# EasyEDA schematic SCH_RAILWAY TRACK CRACK DETECTION SYSTEM_2021-07-08.json
TITLE: RAILWAY TRACK CRACK DETECTION SYSTEM; REV: 1.0; Date: 2021-05-22; Sheet: 1/1; Drawn By: ATUL DIGHE; Company: SAI SOLUTIONS
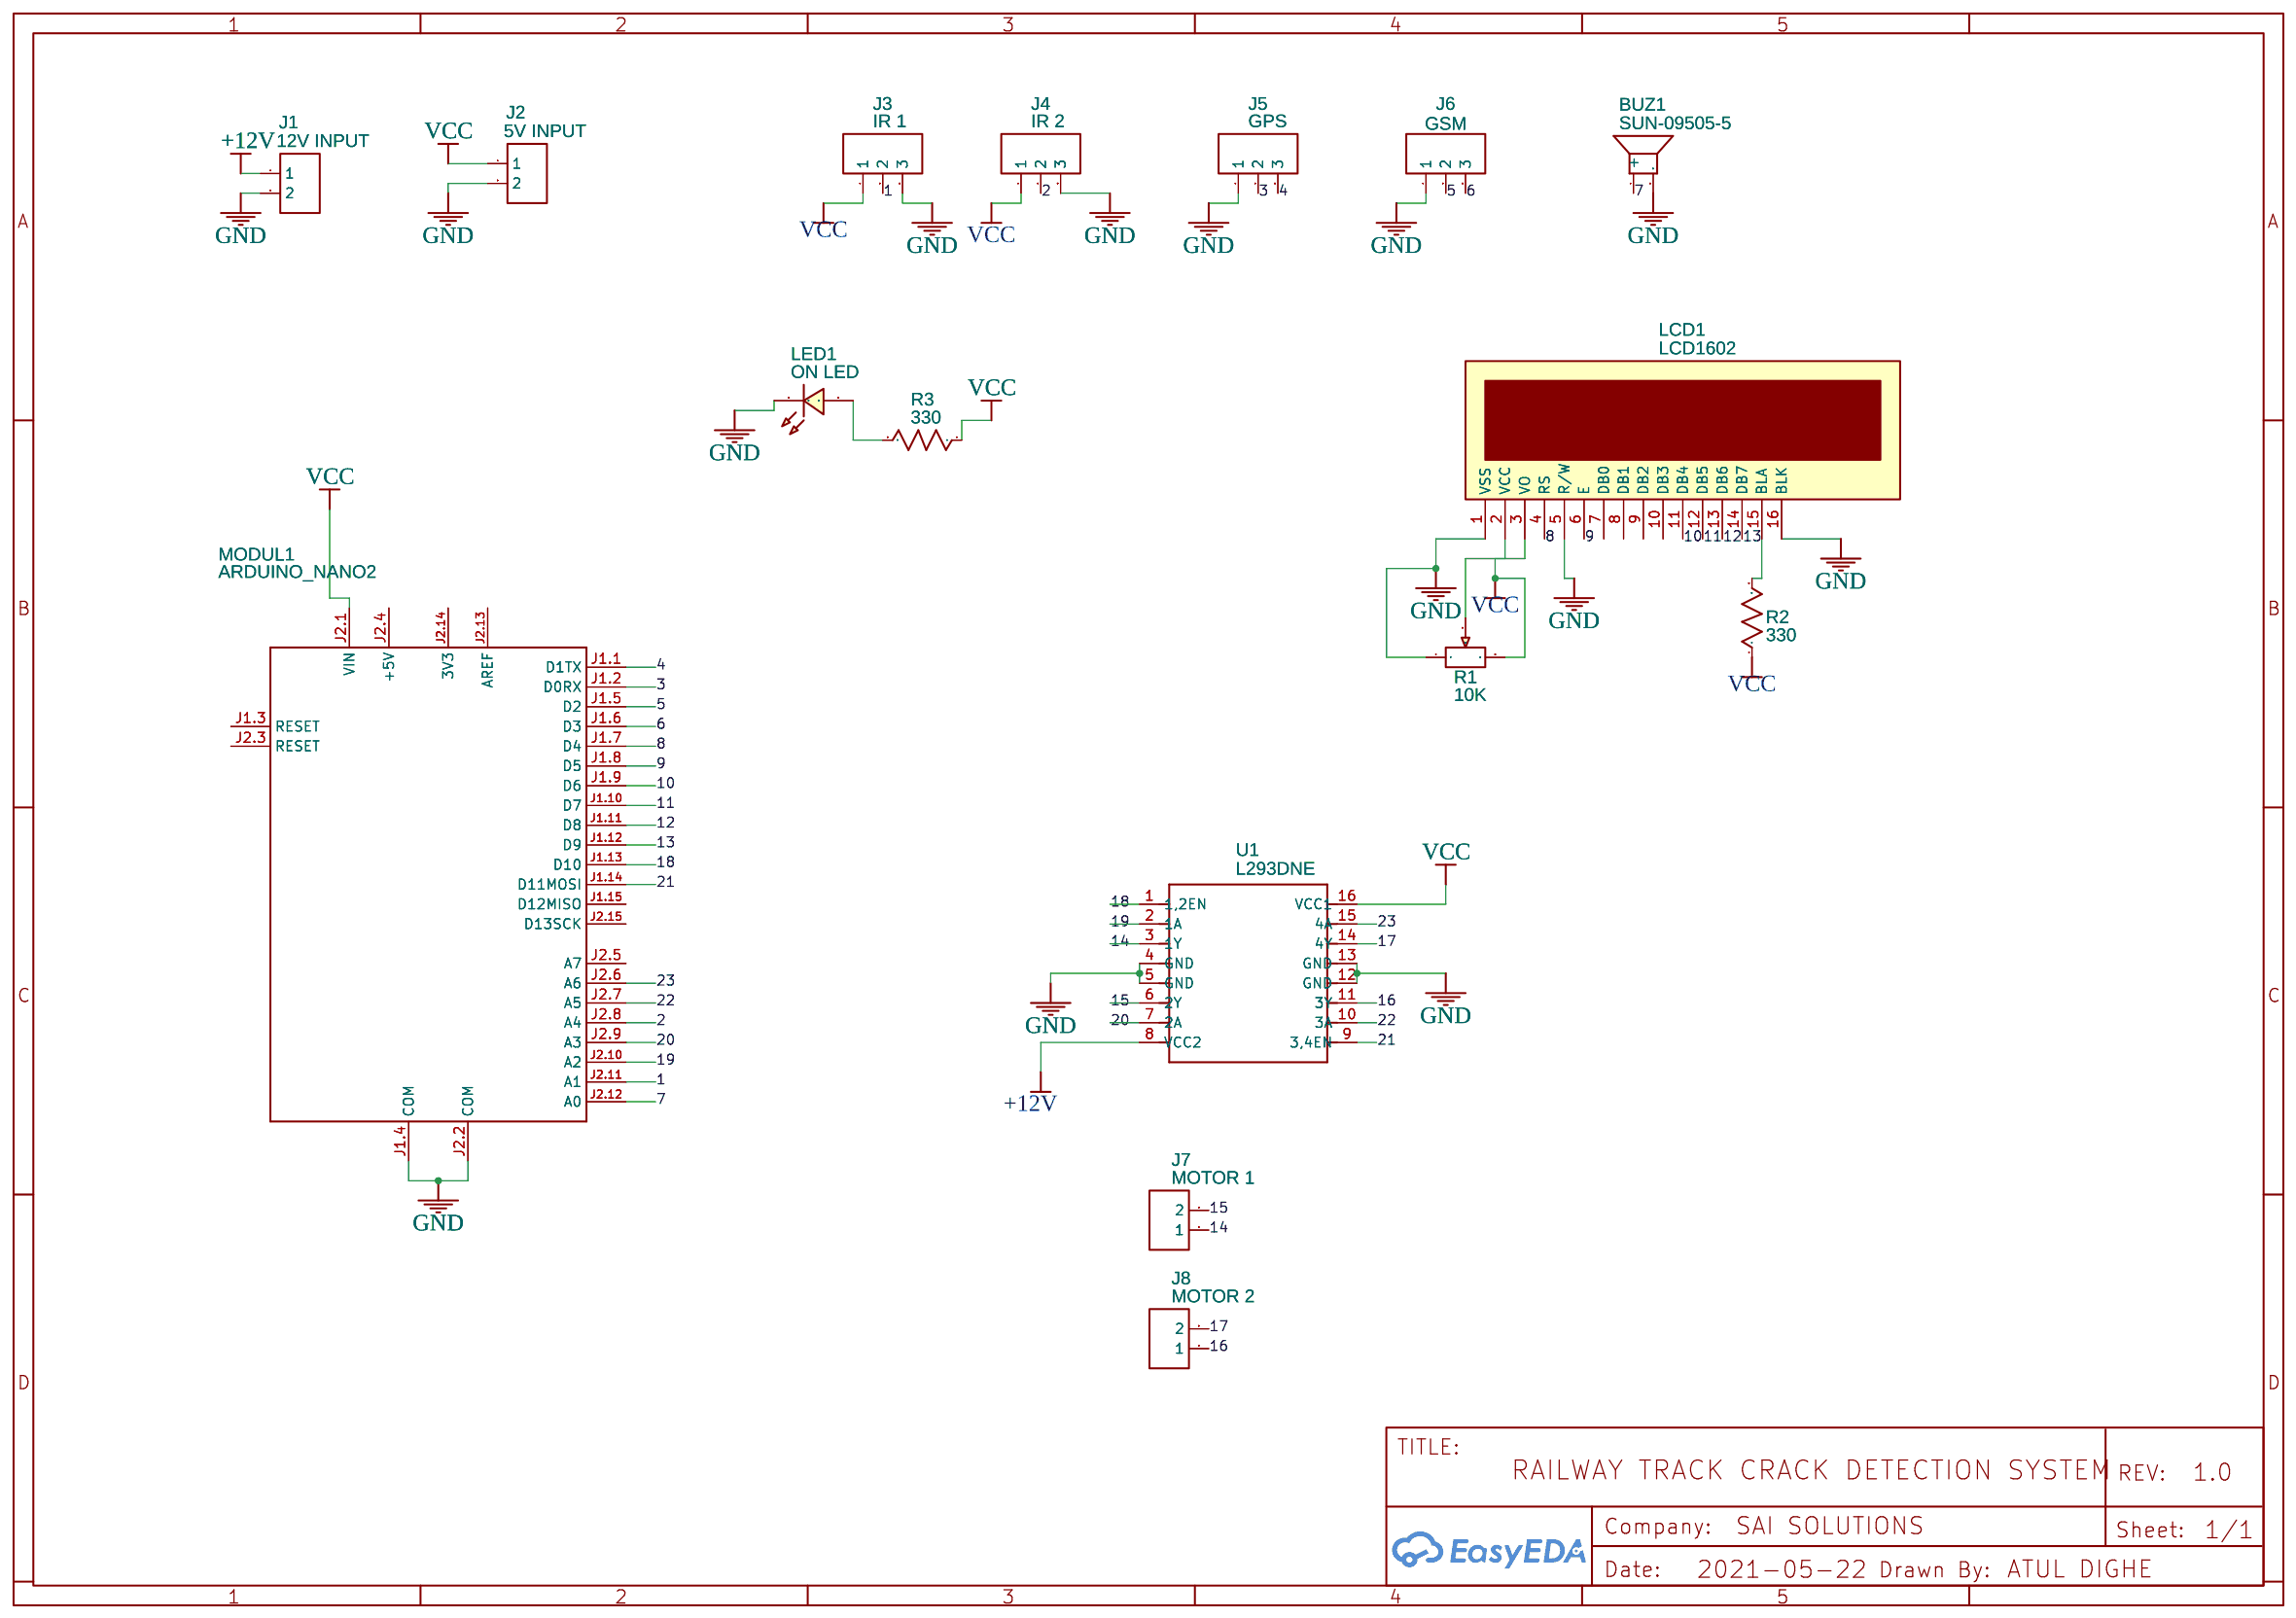
[diagram p0: schematic sheet]

## Parts
BUZ1  SUN-09505-5  [BUZ-TH_BD9.6-P5.00-D0.7-FD]
J1  12V INPUT  [HDR-M-2.54_1X2]
J2  5V INPUT  [HDR-M-2.54_1X2]
J3  IR 1  [HDR-M-2.54_1X3]
J4  IR 2  [HDR-M-2.54_1X3]
J5  GPS  [HDR-M-2.54_1X3]
J6  GSM  [HDR-M-2.54_1X3]
J7  MOTOR 1  [HDR-M-2.54_1X2]
J8  MOTOR 2  [HDR-M-2.54_1X2]
LCD1  LCD1602  [LCD1602]
LED1  ON LED  [LED-TH_BD5.0_RED]
MODUL1  ARDUINO_NANO2  [ARDUINO_NANO2]
R1  10K  [RES-ADJ-TH_RM063-103]
R2  330  [R_AXIAL-0.4]
R3  330  [R_AXIAL-0.4]
U1  L293DNE  [DIP16-2.54-19.2X7.62MM]

## Library data of the parts
BUZ1 = SUN-09505-5: Supplier Part: C2862; Supplier: LCSC; Manufacturer: ReliaPro
J1 J2 J7 J8 = HDR-M-2.54_1x2: Supplier Part: C124375; Supplier: LCSC; Contributor: LCEDA_Lib
J3-J6 = HDR-M-2.54_1x3: Supplier Part: C180248; Supplier: LCSC; Contributor: LCEDA_Lib
LCD1 = LCD1602: Manufacturer: LONTECH(厦门龙特); Manufacturer Part: LCM1602K-NSW-BBW; Supplier Part: C83275; Supplier: LCSC; Contributor: LCEDA_Lib
LED1 = LED-TH-5mm_R: Manufacturer: EVERLIGHT(台湾亿光); Manufacturer Part: 333-2SURD/S530-A3; Supplier Part: C87271; Supplier: LCSC; Contributor: LCEDA_Lib
MODUL1 = ARDUINO_NANO2
R1 = RM063-103 10K: Supplier: LCSC; Manufacturer: JML; Supplier Part: C38793; Package Display: No
R2 R3 = R_AXIAL-0.4_US: Contributor: LCEDA_Lib
U1 = L293DNE: DIP IC Driver;; sourceId: qoicuM4mD

## Nets
+12V: J1.1 U1.8(VCC2)
GND: BUZ1.2 J1.2 J2.2 J3.3 J4.3 J5.1 J6.1 LCD1.1(VSS) LCD1.5(R/W) LCD1.16(BLK) LED1.2 MODUL1.J1.4(COM) MODUL1.J2.2(COM) R1.1 U1.4(GND) U1.5(GND) U1.12(GND) U1.13(GND)
VCC: J2.1 J3.1 J4.1 LCD1.2(VCC) MODUL1.J2.1(VIN) R1.3 R2.1 R3.1 U1.16(VCC1)
1: J3.2 MODUL1.J2.11(A1)
2: J4.2 MODUL1.J2.8(A4)
3: J5.2 MODUL1.J1.2(D0RX)
4: J5.3 MODUL1.J1.1(D1TX)
5: J6.2 MODUL1.J1.5(D2)
6: J6.3 MODUL1.J1.6(D3)
7: BUZ1.1(+) MODUL1.J2.12(A0)
8: LCD1.4(RS) MODUL1.J1.7(D4)
9: LCD1.6(E) MODUL1.J1.8(D5)
10: LCD1.11(DB4) MODUL1.J1.9(D6)
11: LCD1.12(DB5) MODUL1.J1.10(D7)
12: LCD1.13(DB6) MODUL1.J1.11(D8)
13: LCD1.14(DB7) MODUL1.J1.12(D9)
14: J7.1 U1.3(1Y)
15: J7.2 U1.6(2Y)
16: J8.1 U1.11(3Y)
17: J8.2 U1.14(4Y)
18: MODUL1.J1.13(D10) U1.1(1,2EN)
19: MODUL1.J2.10(A2) U1.2(1A)
20: MODUL1.J2.9(A3) U1.7(2A)
21: MODUL1.J1.14(D11MOSI) U1.9(3,4EN)
22: MODUL1.J2.7(A5) U1.10(3A)
23: MODUL1.J2.6(A6) U1.15(4A)
Net-(LCD1-3): LCD1.3(VO) R1.2
Net-(LCD1-15): LCD1.15(BLA) R2.2
Net-(LED1-1): LED1.1 R3.2

Not connected (* = marked no-connect by the designer): LCD1 7(DB0) 8(DB1) 9(DB2) 10(DB3); MODUL1 J1.3(RESET) J1.15(D12MISO) J2.3(RESET) J2.4(+5V) J2.5(A7) J2.13(AREF) J2.14(3V3) J2.15(D13SCK)
